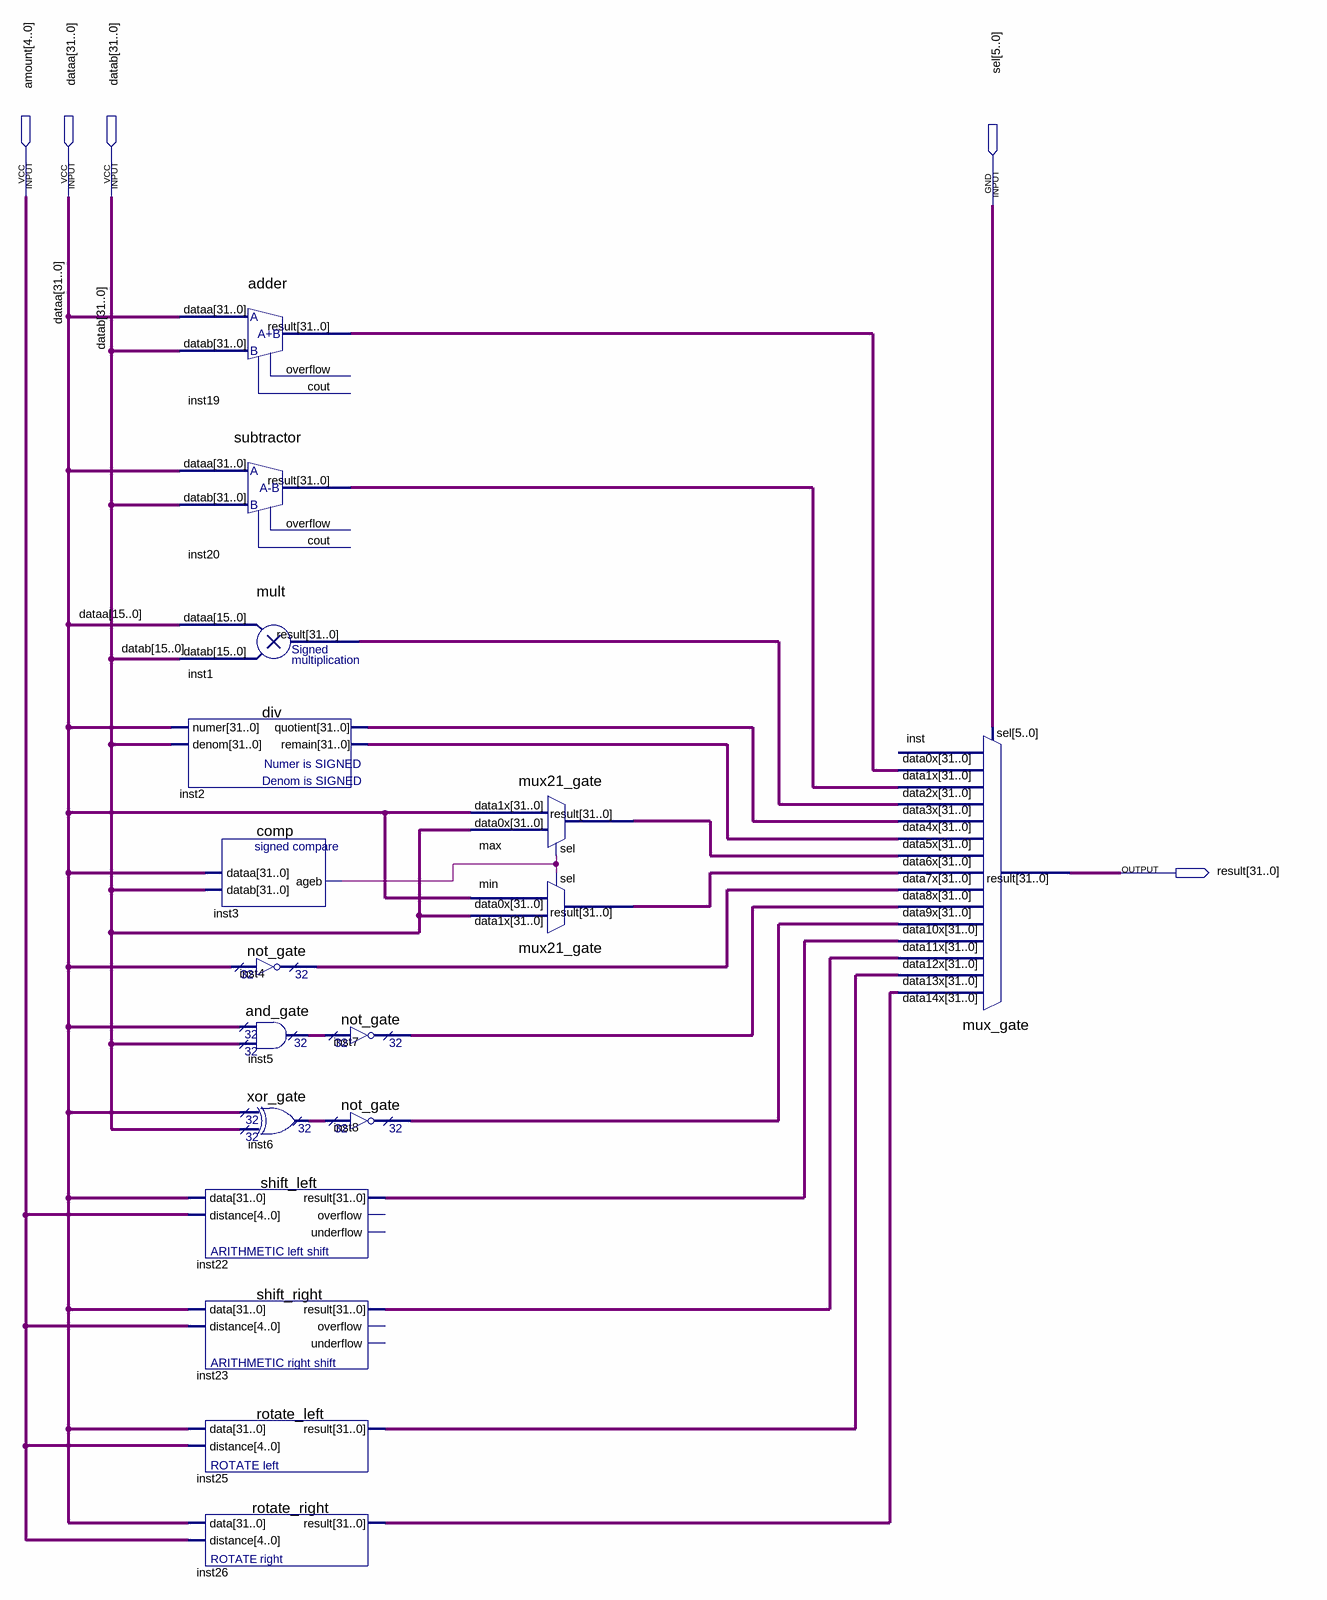
[diagram p0: schematic sheet]
// Quartus schematic ALU.bdf as structural Verilog: 17 symbols, 5 pins
module ALU (
  input  [4:0] amount,
  input  [31:0] dataa,
  input  [31:0] datab,
  input  [5:0] sel,
  output [31:0] result
);

  wire inst3_ageb;
  wire [31:0] inst1_result, inst2_quotient, inst2_remain, inst4_result, inst5_result, inst6_result,
       inst7_result, inst8_result, inst19_result, inst20_result, inst22_result, inst23_result, inst25_result,
       inst26_result, max_result, min_result;

  adder inst19 (.dataa(dataa), .datab(datab), .result(inst19_result));  // open: overflow, cout
  subtractor inst20 (.dataa(dataa), .datab(datab), .result(inst20_result));  // open: overflow, cout
  mult inst1 (.dataa(dataa[15:0]), .datab(datab[15:0]), .result(inst1_result));
  div inst2 (.numer(dataa), .denom(datab), .quotient(inst2_quotient), .remain(inst2_remain));
  comp inst3 (.dataa(dataa), .datab(datab), .ageb(inst3_ageb));
  shift_left inst22 (.data(dataa), .distance(amount), .result(inst22_result));  // open: overflow, underflow
  shift_right inst23 (.data(dataa), .distance(amount), .result(inst23_result));  // open: overflow, underflow
  rotate_left inst25 (.data(dataa), .distance(amount), .result(inst25_result));
  rotate_right inst26 (.data(dataa), .distance(amount), .result(inst26_result));
  not_gate inst4 (.data(dataa), .result(inst4_result));
  and_gate inst5 (.data0x(dataa), .data1x(datab), .result(inst5_result));
  xor_gate inst6 (.data0x(dataa), .data1x(datab), .result(inst6_result));
  not_gate inst7 (.data(inst5_result), .result(inst7_result));
  not_gate inst8 (.data(inst6_result), .result(inst8_result));
  mux21_gate max (.data1x(dataa), .data0x(datab), .sel(inst3_ageb), .result(max_result));
  mux21_gate min (.data1x(datab), .data0x(dataa), .sel(inst3_ageb), .result(min_result));
  mux_gate inst (
    .data14x(inst26_result), .data13x(inst25_result), .data12x(inst23_result), .data11x(inst22_result),
    .data10x(inst8_result), .data9x(inst7_result), .data8x(inst4_result), .data7x(min_result),
    .data6x(max_result), .data5x(inst2_remain), .data4x(inst2_quotient), .data3x(inst1_result),
    .data2x(inst20_result), .data1x(inst19_result), .sel(sel), .result(result));  // open: data0x
endmodule
